# EasyEDA schematic Humidity sensor (attiny85).json
TITLE: Sheet_1; REV: 1.0; Date: 2019-11-10; Sheet: 1/1; Drawn By: yauheni.parakhnevich; Company: Your Company
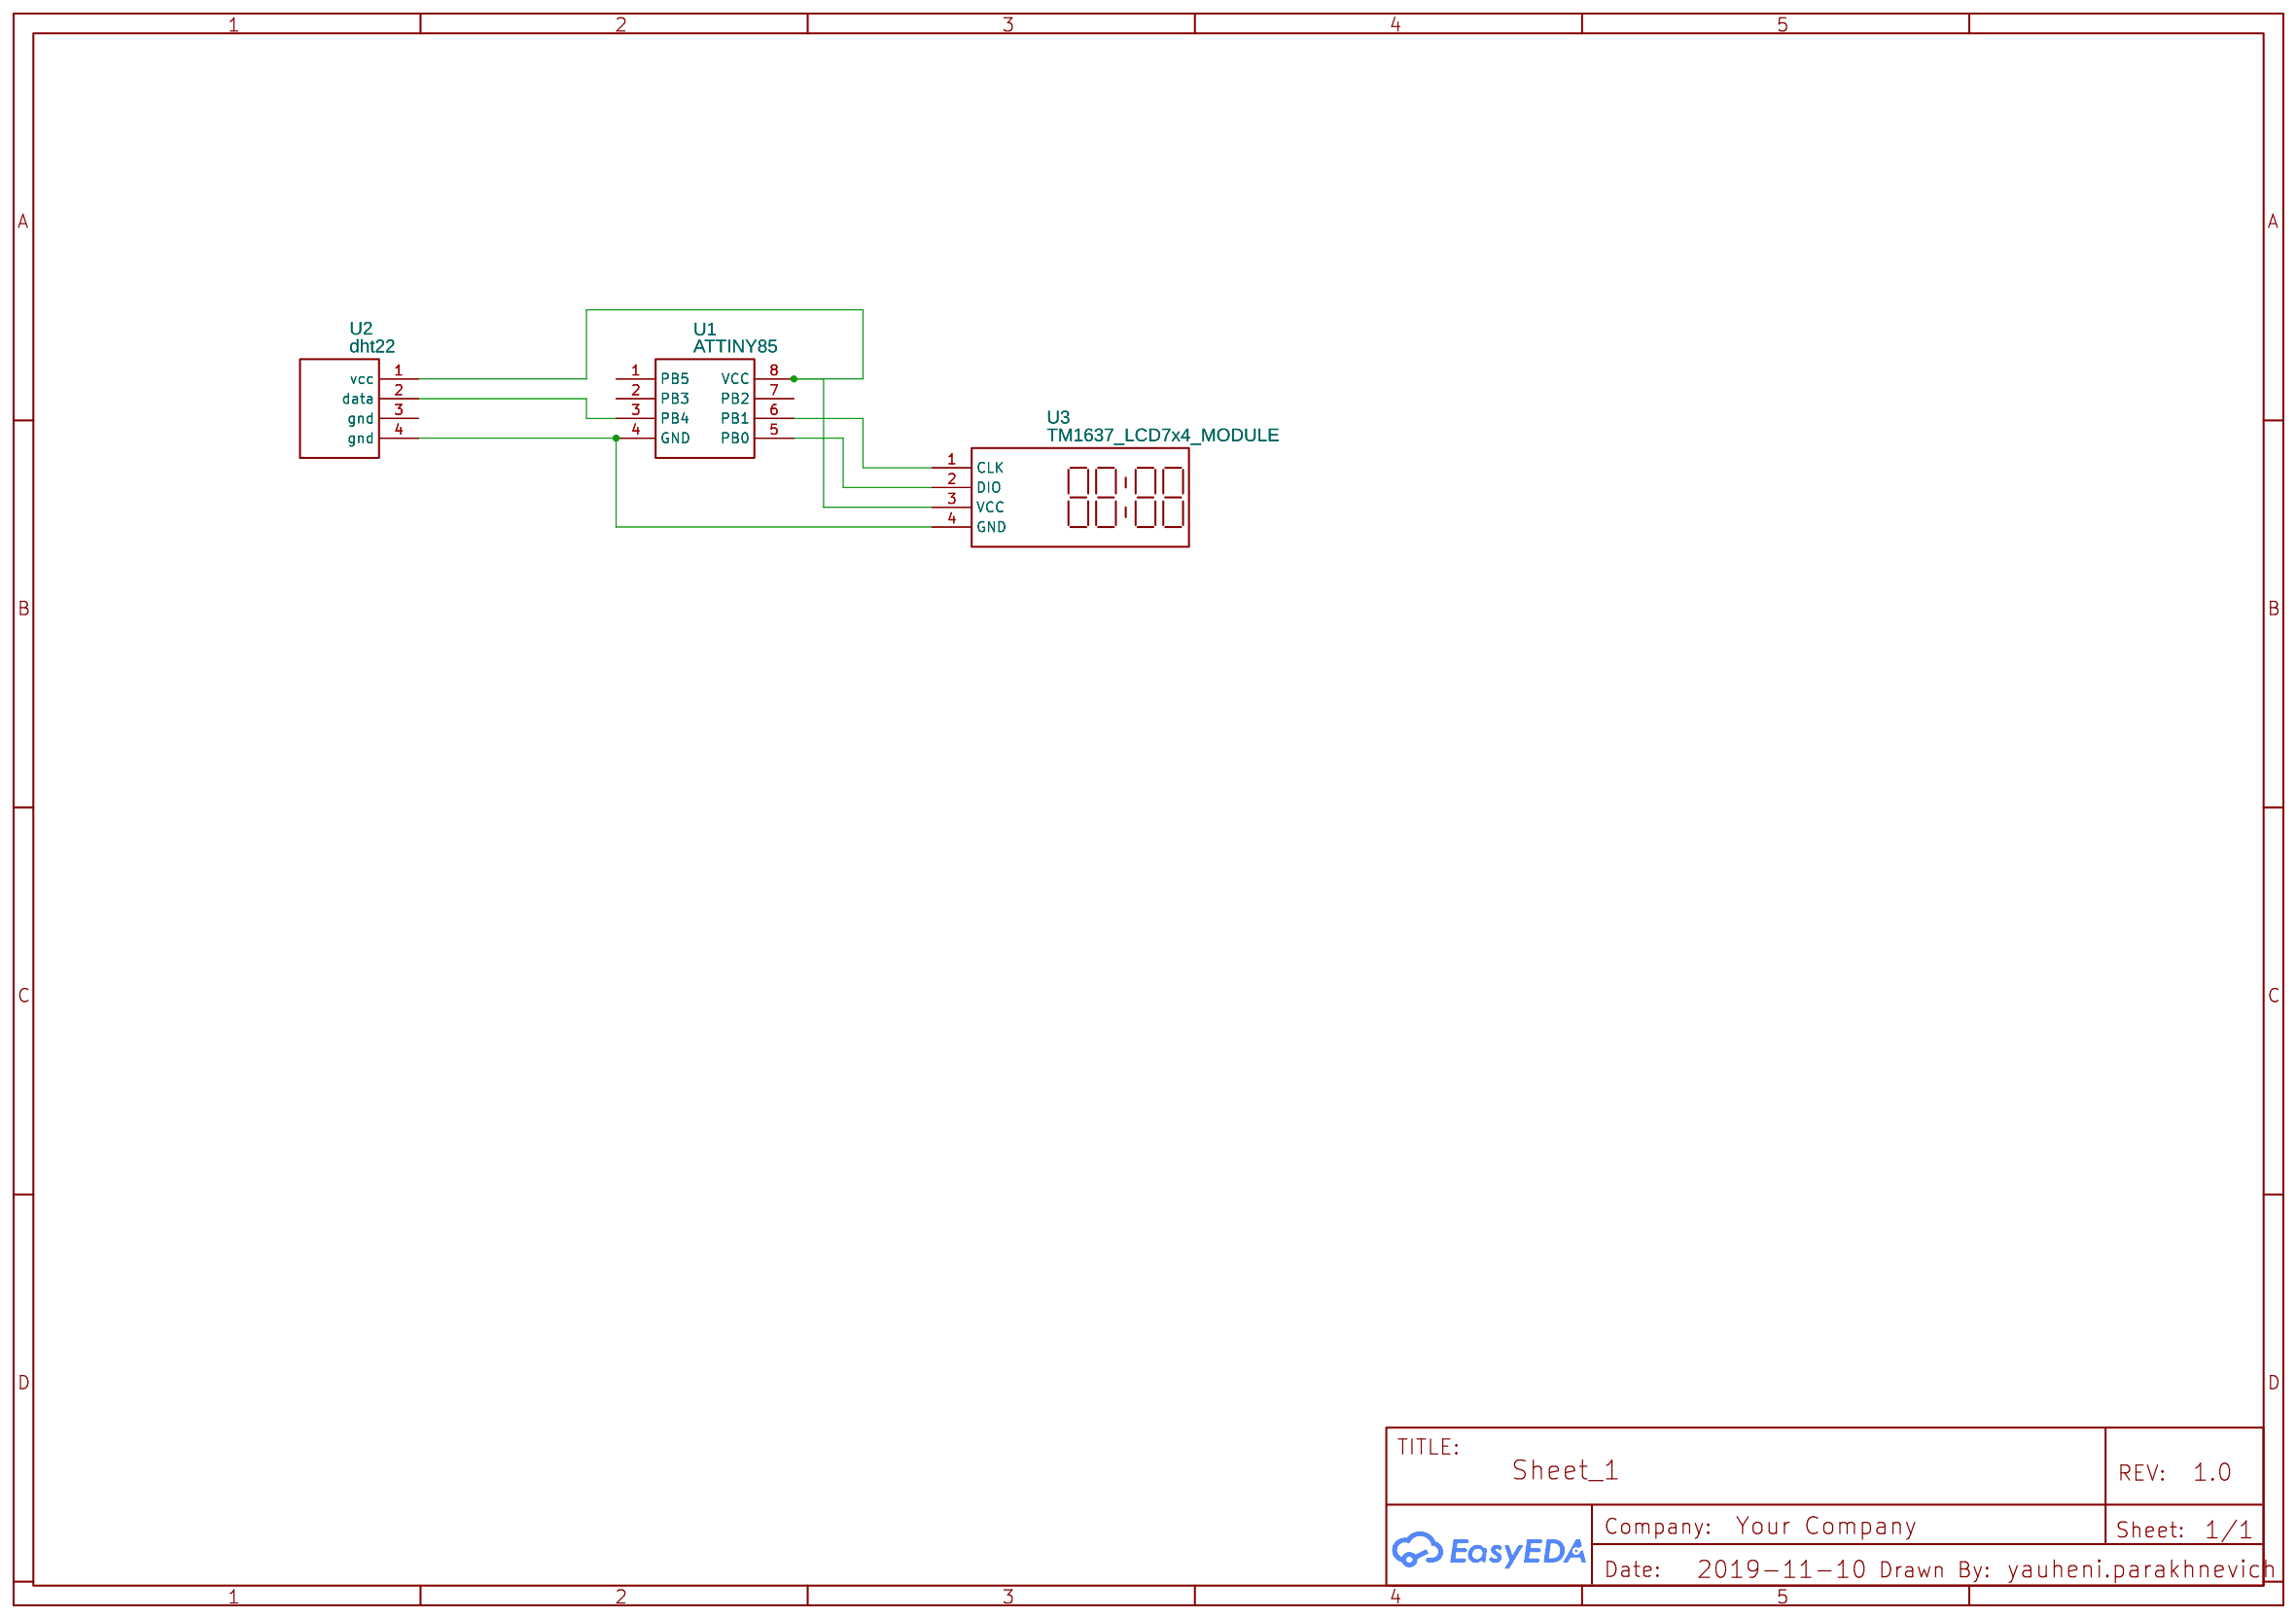
[diagram p0: schematic sheet]

## Parts
U1  ATTINY85  [DIP-8]
U2  dht22  [HDR1X4]
U3  TM1637_LCD7x4_MODULE  [TM1637_LCD_4X7_MODULE]

## Library data of the parts
U1 = ATTINY85: catid: 20; Contributor: jeppe97rc; Supplier Part: undefined
U2 = dht22: Contributor: jes
U3 = TM1637_LCD7x4_MODULE: Contributor: Viacheslav Karpizin; Supplier: ALI; Manufacturer: CATALEX

## Nets
Net-(U1-3): U1.3(PB4) U2.2(data)
Net-(U1-4): U1.4(GND) U2.4(gnd) U3.4(GND)
Net-(U1-5): U1.5(PB0) U3.2(DIO)
Net-(U1-6): U1.6(PB1) U3.1(CLK)
Net-(U1-8): U1.8(VCC) U2.1(vcc) U3.3(VCC)

Not connected (* = marked no-connect by the designer): U1 1(PB5) 2(PB3) 7(PB2); U2 3(gnd)
